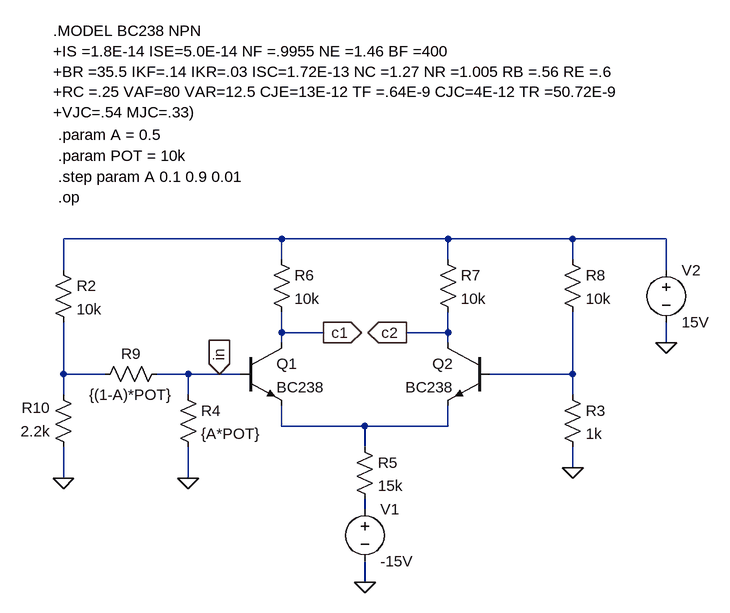
[diagram p0: schematic exercise1_7.asc]
exercise1_7.asc, the LTspice schematic file:
Version 4.1
SHEET 1 1016 680
WIRE 352 -288 16 -288
WIRE 608 -288 352 -288
WIRE 800 -288 608 -288
WIRE 944 -288 800 -288
WIRE 352 -256 352 -288
WIRE 608 -256 608 -288
WIRE 800 -256 800 -288
WIRE 16 -240 16 -288
WIRE 944 -240 944 -288
WIRE 352 -144 352 -176
WIRE 416 -144 352 -144
WIRE 608 -144 608 -176
WIRE 608 -144 544 -144
WIRE 352 -128 352 -144
WIRE 608 -128 608 -144
WIRE 944 -128 944 -160
WIRE 16 -80 16 -160
WIRE 80 -80 16 -80
WIRE 208 -80 160 -80
WIRE 256 -80 208 -80
WIRE 288 -80 256 -80
WIRE 800 -80 800 -176
WIRE 800 -80 672 -80
WIRE 16 -48 16 -80
WIRE 208 -48 208 -80
WIRE 800 -48 800 -80
WIRE 352 0 352 -32
WIRE 480 0 352 0
WIRE 608 0 608 -32
WIRE 608 0 480 0
WIRE 480 32 480 0
WIRE 800 64 800 32
WIRE 16 80 16 32
WIRE 208 80 208 32
WIRE 480 128 480 112
WIRE 480 240 480 208
FLAG 800 64 0
FLAG 480 240 0
FLAG 944 -128 0
FLAG 416 -144 c1
IOPIN 416 -144 Out
FLAG 544 -144 c2
IOPIN 544 -144 Out
FLAG 256 -80 in
IOPIN 256 -80 In
FLAG 16 80 0
FLAG 208 80 0
SYMBOL res 464 16 R0
SYMATTR InstName R5
SYMATTR Value 15k
SYMBOL res 336 -272 R0
SYMATTR InstName R6
SYMATTR Value 10k
SYMBOL res 592 -272 R0
SYMATTR InstName R7
SYMATTR Value 10k
SYMBOL res 784 -272 R0
SYMATTR InstName R8
SYMATTR Value 10k
SYMBOL voltage 480 112 R0
SYMATTR InstName V1
SYMATTR Value -15V
SYMBOL voltage 944 -256 R0
SYMATTR InstName V2
SYMATTR Value 15V
SYMBOL npn 288 -128 R0
SYMATTR InstName Q1
SYMATTR Value BC238
SYMBOL npn 672 -128 M0
SYMATTR InstName Q2
SYMATTR Value BC238
SYMBOL res 0 -256 R0
SYMATTR InstName R2
SYMATTR Value 10k
SYMBOL res 784 -64 R0
SYMATTR InstName R3
SYMATTR Value 1k
SYMBOL res 192 -64 R0
SYMATTR InstName R4
SYMATTR Value {A*POT}
SYMBOL res 176 -96 R90
WINDOW 0 0 56 VBottom 2
WINDOW 3 32 56 VTop 2
SYMATTR InstName R9
SYMATTR Value {(1-A)*POT}
SYMBOL res 32 48 R180
WINDOW 0 36 76 Left 2
WINDOW 3 36 40 Left 2
SYMATTR InstName R10
SYMATTR Value 2.2k
TEXT 0 -608 Left 2 !.MODEL BC238 NPN\n+IS =1.8E-14 ISE=5.0E-14 NF =.9955 NE =1.46 BF =400\n+BR =35.5 IKF=.14 IKR=.03 ISC=1.72E-13 NC =1.27 NR =1.005 RB =.56 RE =.6\n+RC =.25 VAF=80 VAR=12.5 CJE=13E-12 TF =.64E-9 CJC=4E-12 TR =50.72E-9\n+VJC=.54 MJC=.33)
TEXT 8 -416 Left 2 !.param POT = 10k
TEXT 8 -448 Left 2 !.param A = 0.5
TEXT 8 -384 Left 2 !.step param A 0.1 0.9 0.01
TEXT 8 -352 Left 2 !.op

The netlist it stands for:
* exercise1_7.asc
R5 N004 N005 15k
R6 N001 c1 10k
R7 N001 c2 10k
R8 N001 N003 10k
V1 N005 0 -15V
V2 N001 0 15V
Q1 c1 in N004 0 BC238
Q2 c2 N003 N004 0 BC238
R2 N001 N002 10k
R3 N003 0 1k
R4 in 0 {A*POT}
R9 in N002 {(1-A)*POT}
R10 0 N002 2.2k
.model NPN NPN
.model PNP PNP
.lib standard.bjt
.MODEL BC238 NPN
+IS =1.8E-14 ISE=5.0E-14 NF =.9955 NE =1.46 BF =400
+BR =35.5 IKF=.14 IKR=.03 ISC=1.72E-13 NC =1.27 NR =1.005 RB =.56 RE =.6
+RC =.25 VAF=80 VAR=12.5 CJE=13E-12 TF =.64E-9 CJC=4E-12 TR =50.72E-9
+VJC=.54 MJC=.33)
.param POT = 10k
.param A = 0.5
.step param A 0.1 0.9 0.01
.op
.backanno
.end